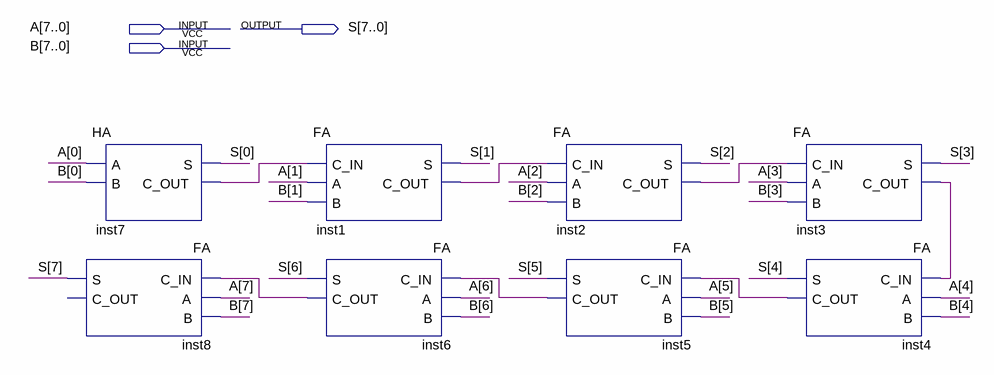
[diagram p0: schematic sheet]
// Quartus schematic RCA_8BIT.bdf as structural Verilog: 8 symbols, 3 pins
module RCA_8BIT (
  input  [7:0] A,
  input  [7:0] B,
  output [7:0] S
);

  wire inst1_c_out, inst2_c_out, inst3_c_out, inst4_c_out, inst5_c_out, inst6_c_out, inst7_c_out;

  HA inst7 (.A(A[0]), .B(B[0]), .S(S[0]), .C_OUT(inst7_c_out));
  FA inst8 (.C_IN(inst6_c_out), .A(A[7]), .B(B[7]), .S(S[7]));  // open: C_OUT
  FA inst1 (.C_IN(inst7_c_out), .A(A[1]), .B(B[1]), .S(S[1]), .C_OUT(inst1_c_out));
  FA inst6 (.C_IN(inst5_c_out), .A(A[6]), .B(B[6]), .S(S[6]), .C_OUT(inst6_c_out));
  FA inst2 (.C_IN(inst1_c_out), .A(A[2]), .B(B[2]), .S(S[2]), .C_OUT(inst2_c_out));
  FA inst5 (.C_IN(inst4_c_out), .A(A[5]), .B(B[5]), .S(S[5]), .C_OUT(inst5_c_out));
  FA inst3 (.C_IN(inst2_c_out), .A(A[3]), .B(B[3]), .S(S[3]), .C_OUT(inst3_c_out));
  FA inst4 (.C_IN(inst3_c_out), .A(A[4]), .B(B[4]), .S(S[4]), .C_OUT(inst4_c_out));
endmodule
